# Altium schematic sheet DDR3_16bits.SchDoc: DDR3L 16 bits
size A4; Date: 30-MAR-2016; Author: F.L; CompanyName: STMicroelectronics; Organization: MCD/APPLI/HW; Address1: 12, Rue Jules HOROWITZ; Address2: 38019 Grenoble; Address3: FRANCE; DocumentNumber: MB1272; Revision: A-01; SheetNumber: 11; SheetTotal: 15; Project: STM32MP15-DISCO PI; PageSetup: Record=PageOptions|CenterHorizontal=True|CenterVertical=True|PrintScale=1.39|XCorrection=1.00|YCorrection=1.00|PrintKind=1|BorderSize=5000000|LeftOffset=0|BottomOffset=0|Orientation=2|PaperLength=1000|PaperWidth=1000|Scale=100|PaperSource=15|PrintQuality=600|MediaType=1|DitherType=10|PrintScaleMode=1|PaperKind=A3|PaperIndex=8
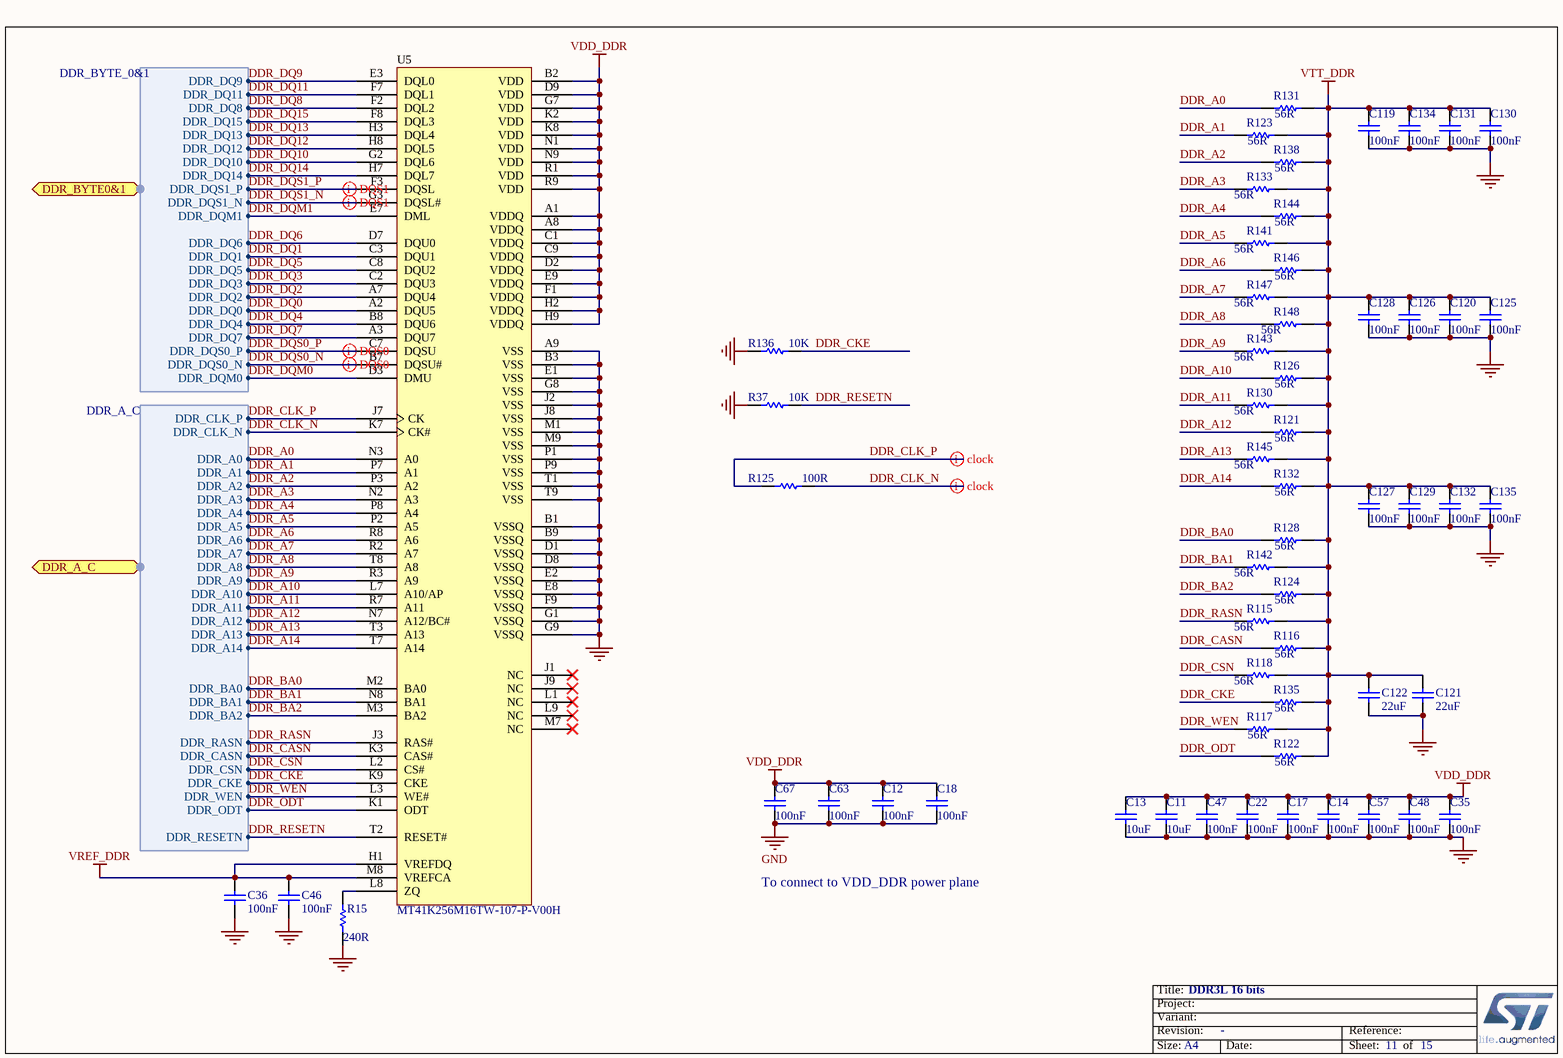
[diagram p0: DDR3_16bits.SchDoc]

## Parts
C11  value 10uF  [C0603]  (hidden comment: Capacitor)
C12  value 100nF  [C0402]  (hidden comment: Capacitor)
C13  value 10uF  [C0603]  (hidden comment: Capacitor)
C14  value 100nF  [C0402]
C17  value 100nF  [C0402]
C18  value 100nF  [C0402]  (hidden comment: Capacitor)
C22  value 100nF  [C0402]
C35  value 100nF  [C0402]
C36  value 100nF  [C0402]
C46  value 100nF  [C0402]
C47  value 100nF  [C0402]
C48  value 100nF  [C0402]
C57  value 100nF  [C0402]
C63  value 100nF  [C0402]  (hidden comment: Capacitor)
C67  value 100nF  [C0402]  (hidden comment: Capacitor)
C119  value 100nF  [C0402]
C120  value 100nF  [C0402]
C121  value 22uF  [C0603]
C122  value 22uF  [C0603]
C125  value 100nF  [C0402]
C126  value 100nF  [C0402]
C127  value 100nF  [C0402]
C128  value 100nF  [C0402]
C129  value 100nF  [C0402]
C130  value 100nF  [C0402]
C131  value 100nF  [C0402]
C132  value 100nF  [C0402]
C134  value 100nF  [C0402]
C135  value 100nF  [C0402]
R15  value 240R  [R0402]
R37  value 10K  [R0402]  (hidden comment: Resistor)
R115  value 56R  [R0402]
R116  value 56R  [R0402]
R117  value 56R  [R0402]
R118  value 56R  [R0402]
R121  value 56R  [R0402]
R122  value 56R  [R0402]
R123  value 56R  [R0402]
R124  value 56R  [R0402]
R125  value 100R  [R0402]  (hidden comment: Resistor)
R126  value 56R  [R0402]
R128  value 56R  [R0402]
R130  value 56R  [R0402]
R131  value 56R  [R0402]
R132  value 56R  [R0402]
R133  value 56R  [R0402]
R135  value 56R  [R0402]
R136  value 10K  [R0402]  (hidden comment: Resistor)
R138  value 56R  [R0402]
R141  value 56R  [R0402]
R142  value 56R  [R0402]
R143  value 56R  [R0402]
R144  value 56R  [R0402]
R145  value 56R  [R0402]
R146  value 56R  [R0402]
R147  value 56R  [R0402]
R148  value 56R  [R0402]
U5  value MT41K256M16TW-107-P-V00H  [ICC_FBGA96_8X14_P080]  (hidden comment: MT41K256M16TW-107:P - V00H)

## Ports
DDR_A_C (harness DDR_A_C), DDR_BYTE0&1 (harness DDR_BYTE_0&1)

## Harnesses
DDR_A_C: DDR_A4, DDR_A0, DDR_A2, DDR_A1, DDR_A6, DDR_A3, DDR_A5, DDR_A7, DDR_A8, DDR_A9, DDR_A14, DDR_A10, DDR_A12, DDR_A11, DDR_BA0, DDR_A13, DDR_BA1, DDR_BA2, DDR_RASN, DDR_CASN, DDR_CSN, DDR_CKE, DDR_WEN, DDR_ODT, DDR_CLK_P, DDR_CLK_N, DDR_RESETN
DDR_BYTE_0&1: DDR_DQ13, DDR_DQ9, DDR_DQ8, DDR_DQ11, DDR_DQ10, DDR_DQ15, DDR_DQ12, DDR_DQ14, DDR_DQS1_P, DDR_DQS1_N, DDR_DQ5, DDR_DQM1, DDR_DQ6, DDR_DQ2, DDR_DQ1, DDR_DQ3, DDR_DQ0, DDR_DQ4, DDR_DQ7, DDR_DQS0_P, DDR_DQS0_N, DDR_DQM0

## Nets
GND: C11.1 C12.1 C13.1 C14.2 C17.2 C18.1 C22.2 C35.2 C36.2 C46.2 C47.2 C48.2 C57.2 C63.1 C67.1 C119.2 C120.2 C121.1 C122.1 C125.2 C126.2 C127.2 C128.2 C129.2 C130.2 C131.2 C132.2 C134.2 C135.2 R15.1 R37.1 R136.1 U5.A9(VSS) U5.B1(VSSQ) U5.B3(VSS) U5.B9(VSSQ) U5.D1(VSSQ) U5.D8(VSSQ) U5.E1(VSS) U5.E2(VSSQ) U5.E8(VSSQ) U5.F9(VSSQ) U5.G1(VSSQ) U5.G8(VSS) U5.G9(VSSQ) U5.J2(VSS) U5.J8(VSS) U5.M1(VSS) U5.M9(VSS) U5.P1(VSS) U5.P9(VSS) U5.T1(VSS) U5.T9(VSS)
VDD_DDR: C11.2 C12.2 C13.2 C14.1 C17.1 C18.2 C22.1 C35.1 C47.1 C48.1 C57.1 C63.2 C67.2 U5.A1(VDDQ) U5.A8(VDDQ) U5.B2(VDD) U5.C1(VDDQ) U5.C9(VDDQ) U5.D2(VDDQ) U5.D9(VDD) U5.E9(VDDQ) U5.F1(VDDQ) U5.G7(VDD) U5.H2(VDDQ) U5.H9(VDDQ) U5.K2(VDD) U5.K8(VDD) U5.N1(VDD) U5.N9(VDD) U5.R1(VDD) U5.R9(VDD)
VREF_DDR: C36.1 C46.1 U5.H1(VREFDQ) U5.M8(VREFCA)
VTT_DDR: C119.1 C120.1 C121.2 C122.2 C125.1 C126.1 C127.1 C128.1 C129.1 C130.1 C131.1 C132.1 C134.1 C135.1 R115.2 R116.2 R117.2 R118.2 R121.2 R122.2 R123.2 R124.2 R126.2 R128.2 R130.2 R131.2 R132.2 R133.2 R135.2 R138.2 R141.2 R142.2 R143.2 R144.2 R145.2 R146.2 R147.2 R148.2
DDR_A0: R131.1 U5.N3(A0) ; port DDR_A_C.DDR_A0
DDR_A1: R123.1 U5.P7(A1) ; port DDR_A_C.DDR_A1
DDR_A2: R138.1 U5.P3(A2) ; port DDR_A_C.DDR_A2
DDR_A3: R133.1 U5.N2(A3) ; port DDR_A_C.DDR_A3
DDR_A4: R144.1 U5.P8(A4) ; port DDR_A_C.DDR_A4
DDR_A5: R141.1 U5.P2(A5) ; port DDR_A_C.DDR_A5
DDR_A6: R146.1 U5.R8(A6) ; port DDR_A_C.DDR_A6
DDR_A7: R147.1 U5.R2(A7) ; port DDR_A_C.DDR_A7
DDR_A8: R148.1 U5.T8(A8) ; port DDR_A_C.DDR_A8
DDR_A9: R143.1 U5.R3(A9) ; port DDR_A_C.DDR_A9
DDR_A10: R126.1 U5.L7(A10/AP) ; port DDR_A_C.DDR_A10
DDR_A11: R130.1 U5.R7(A11) ; port DDR_A_C.DDR_A11
DDR_A12: R121.1 U5.N7(A12/BC#) ; port DDR_A_C.DDR_A12
DDR_A13: R145.1 U5.T3(A13) ; port DDR_A_C.DDR_A13
DDR_A14: R132.1 U5.T7(A14) ; port DDR_A_C.DDR_A14
DDR_BA0: R128.1 U5.M2(BA0) ; port DDR_A_C.DDR_BA0
DDR_BA1: R142.1 U5.N8(BA1) ; port DDR_A_C.DDR_BA1
DDR_BA2: R124.1 U5.M3(BA2) ; port DDR_A_C.DDR_BA2
DDR_CASN: R116.1 U5.K3(CAS#) ; port DDR_A_C.DDR_CASN
DDR_CKE: R135.1 R136.2 U5.K9(CKE) ; port DDR_A_C.DDR_CKE
DDR_CLK_N: R125.2 U5.K7(CK#) ; port DDR_A_C.DDR_CLK_N
DDR_CLK_P: R125.1 U5.J7(CK) ; port DDR_A_C.DDR_CLK_P
DDR_CSN: R118.1 U5.L2(CS#) ; port DDR_A_C.DDR_CSN
DDR_DQ0: U5.A2(DQU5) ; port DDR_BYTE0&1.DDR_DQ0
DDR_DQ1: U5.C3(DQU1) ; port DDR_BYTE0&1.DDR_DQ1
DDR_DQ2: U5.A7(DQU4) ; port DDR_BYTE0&1.DDR_DQ2
DDR_DQ3: U5.C2(DQU3) ; port DDR_BYTE0&1.DDR_DQ3
DDR_DQ4: U5.B8(DQU6) ; port DDR_BYTE0&1.DDR_DQ4
DDR_DQ5: U5.C8(DQU2) ; port DDR_BYTE0&1.DDR_DQ5
DDR_DQ6: U5.D7(DQU0) ; port DDR_BYTE0&1.DDR_DQ6
DDR_DQ7: U5.A3(DQU7) ; port DDR_BYTE0&1.DDR_DQ7
DDR_DQ8: U5.F2(DQL2) ; port DDR_BYTE0&1.DDR_DQ8
DDR_DQ9: U5.E3(DQL0) ; port DDR_BYTE0&1.DDR_DQ9
DDR_DQ10: U5.G2(DQL6) ; port DDR_BYTE0&1.DDR_DQ10
DDR_DQ11: U5.F7(DQL1) ; port DDR_BYTE0&1.DDR_DQ11
DDR_DQ12: U5.H8(DQL5) ; port DDR_BYTE0&1.DDR_DQ12
DDR_DQ13: U5.H3(DQL4) ; port DDR_BYTE0&1.DDR_DQ13
DDR_DQ14: U5.H7(DQL7) ; port DDR_BYTE0&1.DDR_DQ14
DDR_DQ15: U5.F8(DQL3) ; port DDR_BYTE0&1.DDR_DQ15
DDR_DQM0: U5.D3(DMU) ; port DDR_BYTE0&1.DDR_DQM0
DDR_DQM1: U5.E7(DML) ; port DDR_BYTE0&1.DDR_DQM1
DDR_DQS0_N: U5.B7(DQSU#) ; port DDR_BYTE0&1.DDR_DQS0_N
DDR_DQS0_P: U5.C7(DQSU) ; port DDR_BYTE0&1.DDR_DQS0_P
DDR_DQS1_N: U5.G3(DQSL#) ; port DDR_BYTE0&1.DDR_DQS1_N
DDR_DQS1_P: U5.F3(DQSL) ; port DDR_BYTE0&1.DDR_DQS1_P
DDR_ODT: R122.1 U5.K1(ODT) ; port DDR_A_C.DDR_ODT
DDR_RASN: R115.1 U5.J3(RAS#) ; port DDR_A_C.DDR_RASN
DDR_RESETN: R37.2 U5.T2(RESET#) ; port DDR_A_C.DDR_RESETN
DDR_WEN: R117.1 U5.L3(WE#) ; port DDR_A_C.DDR_WEN
NetR15_2: R15.2 U5.L8(ZQ)

Not connected (* = marked no-connect by the designer): U5 J1(NC)* J9(NC)* L1(NC)* L9(NC)* M7(NC)*

## Layout directives
differential pair: DDR_CLK_N, DDR_CLK_P, DDR_DQS0_N, DDR_DQS0_P, DDR_DQS1_N, DDR_DQS1_P

## Notes on the sheet
- To connect to VDD_DDR power plane
- Title:
- Project:
- Size:
- Revision:
- Variant:
- A4
- -
- Date:
- Reference:
- Sheet:
- of

## Library data of the parts
C11 C13 = MCD-00099: Capacitor, MLCC, 10uF, 10V, X5R, 10%, 0603, T=0,8mm; Manufacturer_Part_Number: GRM188R61A106KE69D; Manufacturer: MURATA; ECCN_US: EAR99; ECCN_EU: NEC; Provided_By: SUBCO; Initial_Board_Reference: MB1262; Internal_Part_Number: MCD-00099; Status: Released; Part_Type: Capacitor; Package: C0603; ComponentLink1Description: Datasheet; ComponentLink1URL: http://tunmcdsvn.tun.st.com/Component_Datasheet_Library/Trunk/Capacitors/Murata_Capacitor_GR_series
C12 C18 C63 C67 = MCD-00006: Capacitor, MLCC, 100nF, 16V, X7R, 10%, 0402, T=0.5mm; Manufacturer_Part_Number: CC0402KRX7R7BB104; Manufacturer: YAGEO; Alternate_Manufacturer: MURATA; Alternate_Manufacturer_Part_Number: GCM155R71C104KA55D; Provided_By: SUBCO; Initial_Board_Reference: MB1274; Internal_Part_Number: MCD-00006; Status: Released; Part_Type: Capacitor; Package: C0402; ComponentLink1Description: Datasheet; ComponentLink1URL: http://tunmcdsvn.tun.st.com/Component_Datasheet_Library/Trunk/Capacitors/Yageo_Multilayer_Capacitor_X7R_series_100pF_to_22uF; ECCN_US: n/a; ECCN_EU: n/a
C14 C17 C22 C35 C36 C46-C48 C57 C119 C120 C125-C132 C134 C135 = MCD-00006: Capacitor,100nF,16V,X7R,10%,0402; Manufacturer_Part_Number: CC0402KRX7R7BB104; Manufacturer: YAGEO; Alternate_Manufacturer: MURATA; Alternate_Manufacturer_Part_Number: GCM155R71C104KA55D; Provided_By: SUBCO; Initial_Board_Reference: mb1274; Internal_Part_Number: MCD-00006; ComponentLink1Description: Datasheet; ECCN_US: n/a; ECCN_EU: n/a; Status: Released; Part_Type: Capacitor; Package: C0402; ComponentLink1URL: http://tunmcdsvn.tun.st.com/Component_Datasheet_Library/Trunk/Capacitors/Yageo_Multilayer_Capacitor_X7R_series_100pF_to_22uF
C121 C122 = MCD-00100: Capacitor, MLCC, 22uF, 6V3, X5R, 20%, 0603, T=0,8mm; Manufacturer_Part_Number: GRM188R60J226MEA0J; Manufacturer: MURATA; ECCN_US: EAR99; ECCN_EU: NEC; Provided_By: SUBCO; Initial_Board_Reference: mb1262; Internal_Part_Number: MCD-00100; Status: Released; Part_Type: Capacitor; Package: C0603; ComponentLink1Description: Datasheet; ComponentLink1URL: http://tunmcdsvn.tun.st.com/Component_Datasheet_Library/Trunk/Capacitors/Murata_Capacitor_GR_series
R15 = MCD-00120: Resistor,240R,0402,1%,1/16W; Manufacturer_Part_Number: RC0402FR-07240RL; Manufacturer: YAGEO; Provided_By: SUBCO; Initial_Board_Reference: mb1262; Internal_Part_Number: MCD-00120; ComponentLink1Description: Datasheet; Status: Released; Part_Type: Resistor; ECCN_US: n/a; ECCN_EU: n/a; ComponentLink1URL: http://tunmcdsvn.tun.st.com/Component_Datasheet_Library/Trunk/Resistors/Yageo_Resistor_RC0402-series; Package: R0402
R37 R136 = MCD-00053: Resistor,10K,0402,1%,1/16W; Manufacturer_Part_Number: RC0402FR-0710KL; Manufacturer: YAGEO; Provided_By: SUBCO; Initial_Board_Reference: MB1274; Internal_Part_Number: MCD-00053; Status: Released; Part_Type: Resistor; Package: R0402; ComponentLink1Description: Datasheet; ComponentLink1URL: http://tunmcdsvn.tun.st.com/Component_Datasheet_Library/Trunk/Resistors/Yageo_Resistor_RC0402-series; ECCN_US: n/a; ECCN_EU: n/a
R115-R118 R121-R124 R126 R128 R130-R133 R135 R138 R141-R148 = MCD-00118: Resistor,56R,0402,1%,1/16W; Manufacturer_Part_Number: RC0402FR-0756RL; Manufacturer: YAGEO; Provided_By: SUBCO; Initial_Board_Reference: mb1262; Internal_Part_Number: MCD-00118; ComponentLink1Description: Datasheet; Status: Released; Part_Type: Resistor; ECCN_US: n/a; ECCN_EU: n/a; ComponentLink1URL: http://tunmcdsvn.tun.st.com/Component_Datasheet_Library/Trunk/Resistors/Yageo_Resistor_RC0402-series; Package: R0402
R125 = MCD-00067: Resistor,100R,0402,1%,1/16W; Manufacturer_Part_Number: RC0402FR-07100RL; Manufacturer: YAGEO; Provided_By: SUBCO; Initial_Board_Reference: MB1274; Internal_Part_Number: MCD-00067; Status: Released; Part_Type: Resistor; Package: R0402; ComponentLink1Description: Datasheet; ComponentLink1URL: http://tunmcdsvn.tun.st.com/Component_Datasheet_Library/Trunk/Resistors/Yageo_Resistor_RC0402-series; ECCN_US: n/a; ECCN_EU: n/a
U5 = MCD-00207: Memory,DDR3L,4Gb,256Mbx16,1866MT/s,1V35,FBGA96; Part_Type: IC; Manufacturer: MICRON; Provided_By: SUBCO; Initial_Board_Reference: MB1263; Internal_Part_Number: MCD-00207; Status: Released; Manufacturer_Part_Number: MT41K256M16TW-107-P-V00H; ComponentLink1Description: Datasheet; ComponentLink1URL: http://tunmcdsvn.tun.st.com/Component_Datasheet_Library/Trunk/IC/Micron_4Gb_DDR3L_MT41K256M16TW-107P-V00H; ECCN_US: n/a; ECCN_EU: n/a